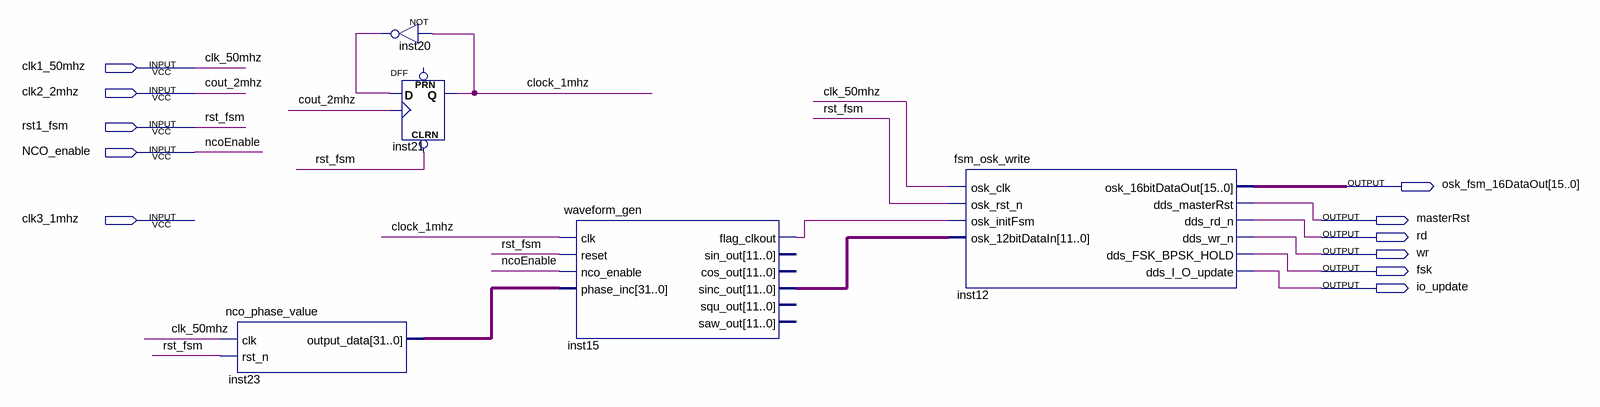
[diagram p0: schematic sheet]
// Quartus schematic osk_nco_fsm_test.bdf as structural Verilog: 5 symbols, 11 pins
module osk_nco_fsm_test (
  input  clk1_50mhz,
  input  clk2_2mhz,
  input  rst1_fsm,
  input  NCO_enable,
  input  clk3_1mhz,
  output [15:0] osk_fsm_16DataOut,
  output masterRst,
  output rd,
  output wr,
  output fsk,
  output io_update
);

  wire clock_1mhz, inst15_flag_clkout, inst20_out;
  wire [11:0] inst15_sinc_out;
  wire [31:0] inst23_output_data;

  nco_phase_value inst23 (.clk(clk1_50mhz), .rst_n(rst1_fsm), .output_data(inst23_output_data));
  not inst20 (inst20_out, clock_1mhz);
  DFF inst21 (.CLRN(rst1_fsm), .CLK(clk2_2mhz), .D(inst20_out), .Q(clock_1mhz));  // open: PRN
  waveform_gen inst15 (
    .clk(clock_1mhz), .reset(rst1_fsm), .nco_enable(NCO_enable), .phase_inc(inst23_output_data),
    .flag_clkout(inst15_flag_clkout), .sinc_out(inst15_sinc_out));  // open: sin_out, cos_out, squ_out, saw_out
  fsm_osk_write inst12 (
    .osk_clk(clk1_50mhz), .osk_rst_n(rst1_fsm), .osk_initFsm(inst15_flag_clkout),
    .osk_12bitDataIn(inst15_sinc_out), .osk_16bitDataOut(osk_fsm_16DataOut), .dds_masterRst(masterRst),
    .dds_rd_n(rd), .dds_wr_n(wr), .dds_FSK_BPSK_HOLD(fsk), .dds_I_O_update(io_update));

  // Other names for the same wires on the sheet: clk_50mhz = clk1_50mhz; cout_2mhz = clk2_2mhz;
  //   ncoEnable = NCO_enable; rst_fsm = rst1_fsm
endmodule
